# EasyEDA Pro project Adorkable_Base_V2_EXP.eprj

# Schematic Schematic1
Board Name: Board1; Create Date: 2024-12-17; Page Name: P1; Project Name: Adorkable_Base_V2_EXP; Schematic Name: Schematic1; Update Date: 2025-08-19; Company: 嘉立创EDA; Page Size: A4; Version: V1.0
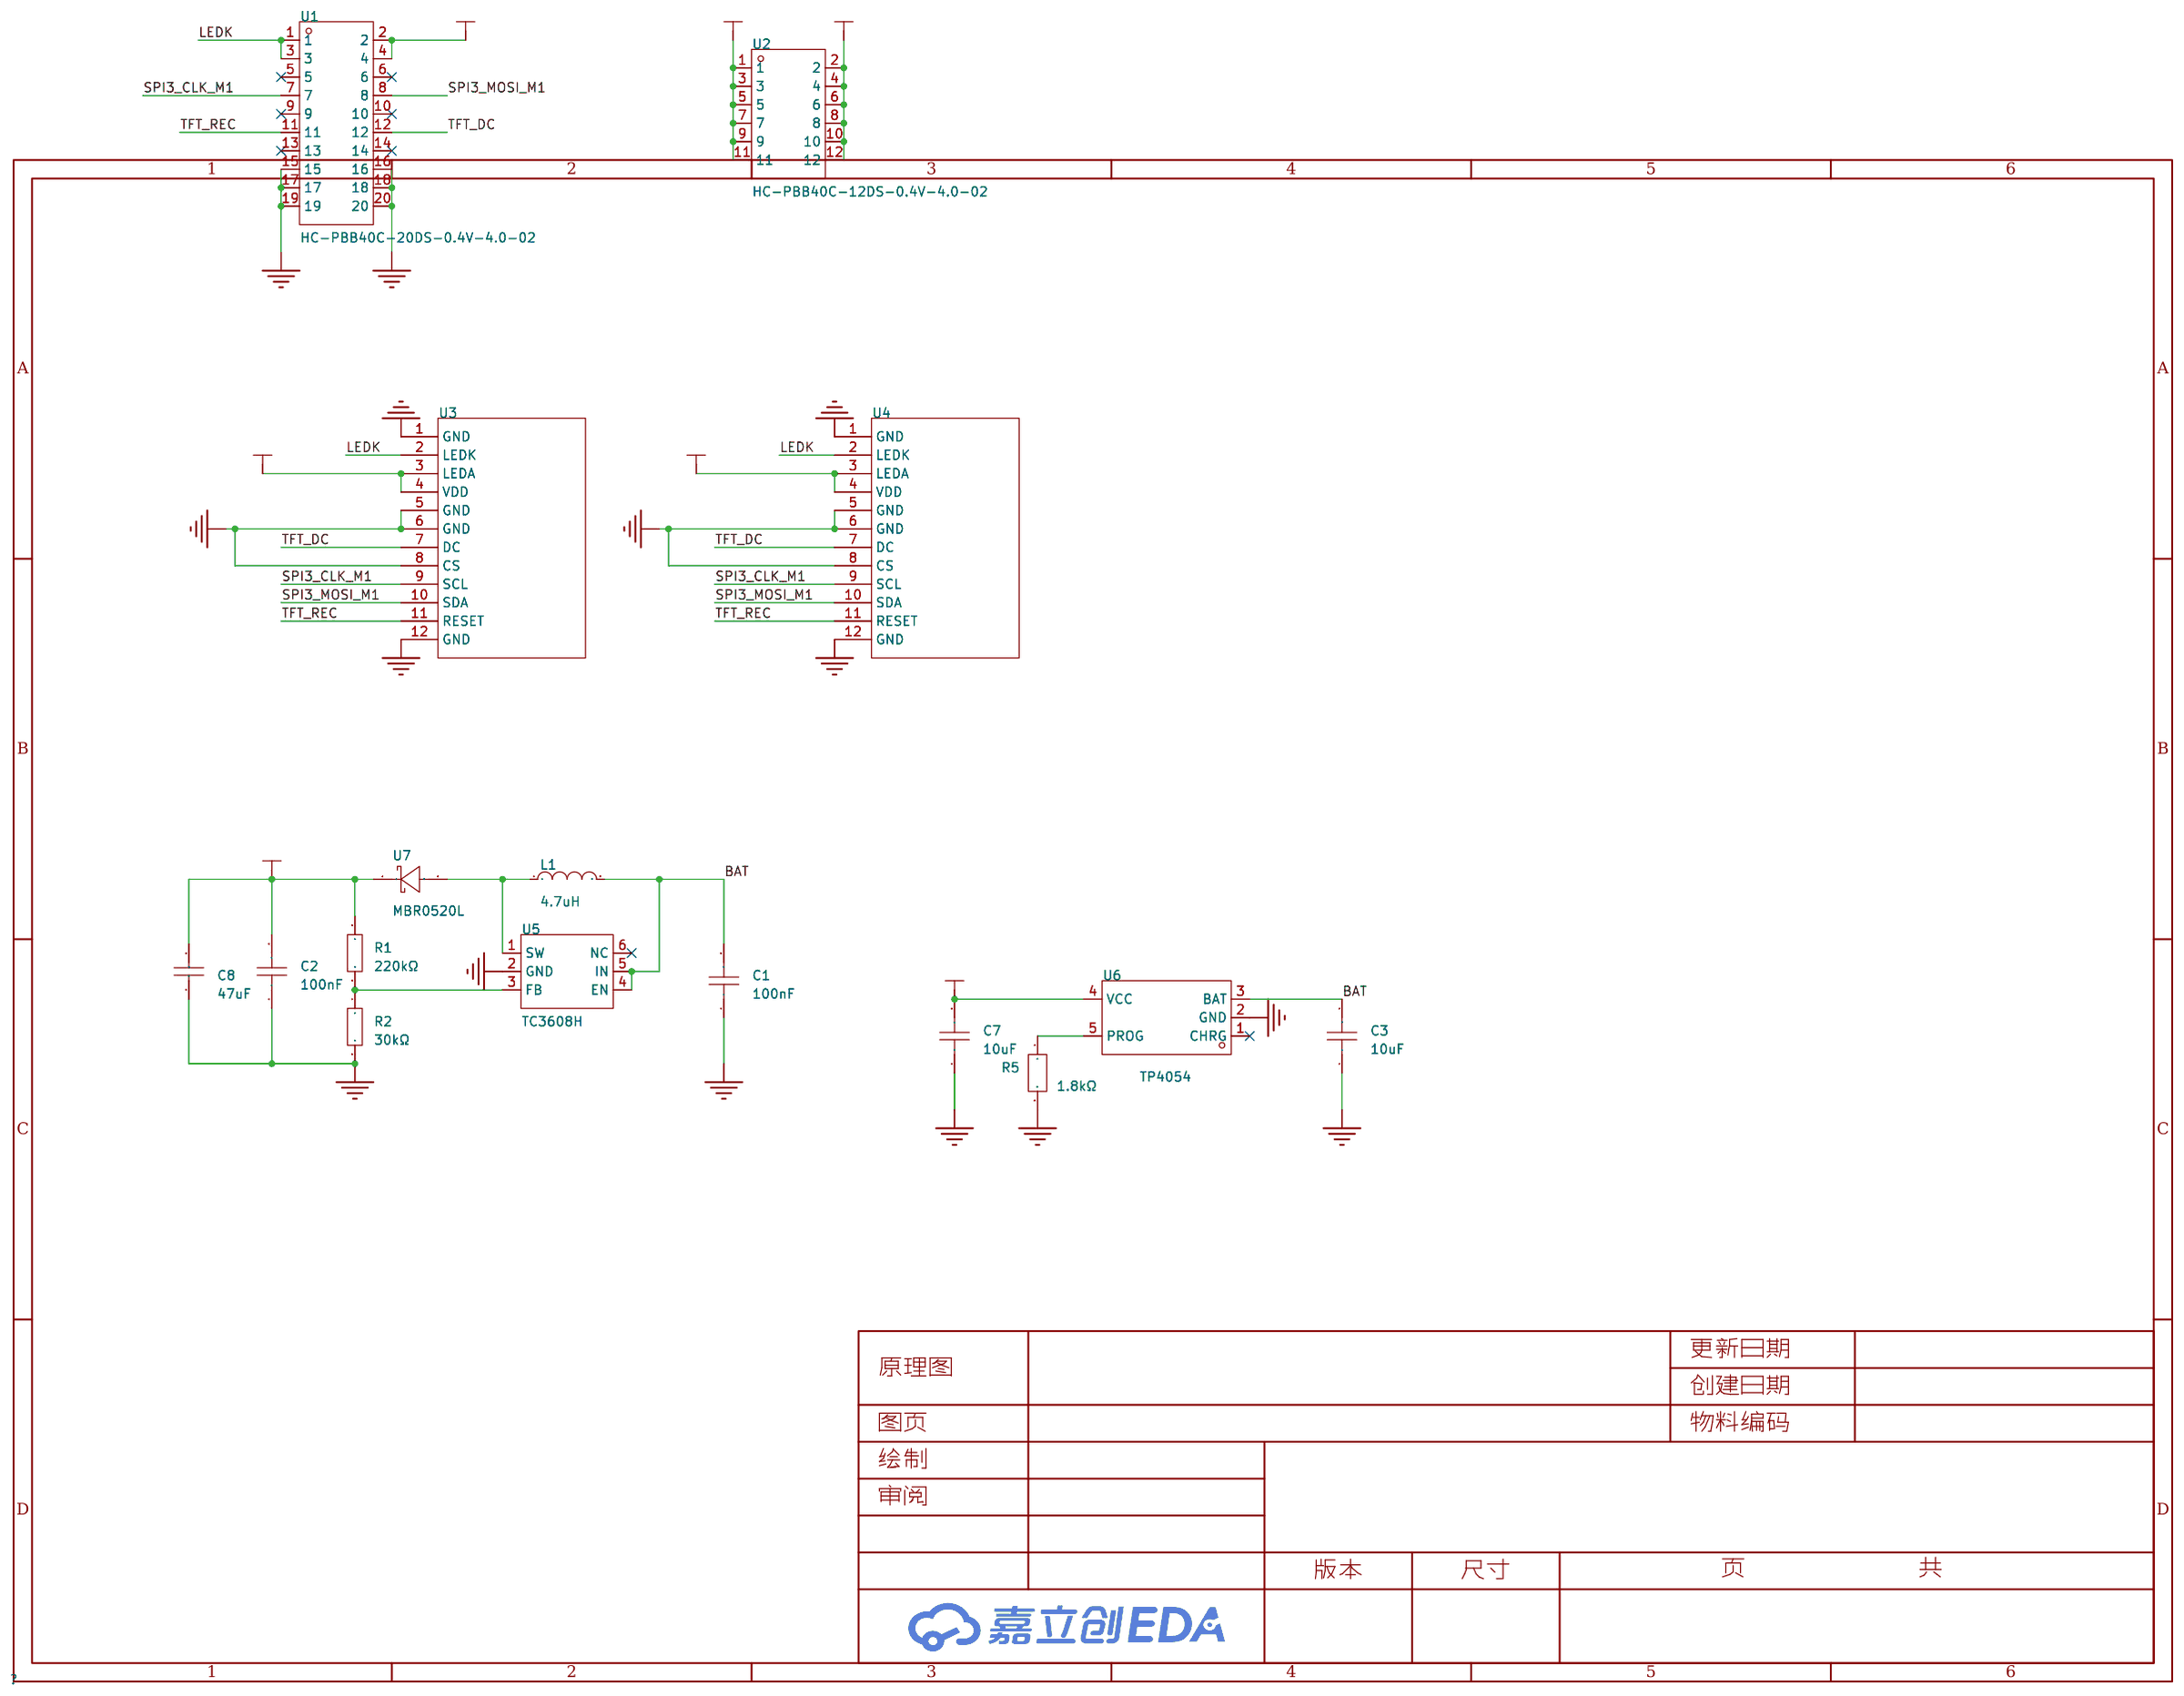
[diagram p0: schematic sheet]

## Parts
C1  100nF  [C0603]
C2  100nF  [C0603]
C3  10uF  [C0603]
C7  10uF  [C0603]
C8  47uF  [C0603]
L1  4.7uH  [IND-SMD_L2.5-W2.0-VLS252012CX-150M]
R1  220kΩ  [R0603]
R2  30kΩ  [R0603]
R5  1.8kΩ  [R0603]
U1  HC-PBB40C-20DS-0.4V-4.0-02  [CONN-SMD_20P-P0.40_DF40C-20DS-0.4V]
U2  HC-PBB40C-12DS-0.4V-4.0-02  [CONN-SMD_12P-P0.40_HC-PBB40C-12DS-0.4V]
U3  -  [LCD]
U4  -  [LCD]
U5  TC3608H  [SOT-23-6_L2.9-W1.6-P0.95-LS2.8-BR]
U6  TP4054  [TSOT-23-5_L2.9-W1.6-P0.95-LS2.8-BR]
U7  MBR0520L  [SOD-123_L2.7-W1.6-LS3.7-RD-1]

## Library data of the parts
C1 C2 = CL10B104KB8NNNC: 容值:100nF;精度:±10%;额定电压:50V;温度系数:X7R;; LCSC Part Name: 100nF ±10% 50V; Supplier Part: C1591; Manufacturer: SAMSUNG(三星); Supplier Footprint: 0603; JLCPCB Part Class: 扩展库; Datasheet: https://item.szlcsc.com/datasheet/CL10B104KB8NNNC/1943.html; Supplier: LCSC; Tolerance: ±10%; Voltage Rating: 50V; Temperature Coefficient: X7R
C3 C7 = CL10A106KP8NNNC: 容值:10uF;精度:±10%;额定电压:10V;温度系数:X5R;; LCSC Part Name: 10uF ±10% 10V; Supplier Part: C19702; Manufacturer: SAMSUNG(三星); Supplier Footprint: 0603; JLCPCB Part Class: 基础库; Datasheet: https://item.szlcsc.com/datasheet/CL10A106KP8NNNC/20411.html; Supplier: LCSC; Tolerance: ±10%; Voltage Rating: 10V; Temperature Coefficient: X5R
C8 = GRM188R60J476ME15D: LCSC Part Name: 47uF ±20% 6.3V; Supplier Part: C140782; Manufacturer: muRata(村田); Supplier Footprint: 0603; JLCPCB Part Class: 扩展库; Datasheet: https://atta.szlcsc.com/upload/public/pdf/source/20171113/C140782_15105612981581115778.pdf; Supplier: LCSC; Tolerance: ±20%; Voltage Rated: 6.3V; Temperature Coefficient: X5R
L1 = FTC252010S4R7MBCA: 电感值:4.7uH;精度:±20%;额定电流:2A;饱和电流(Isat):2.6A;类型:一体成型电感;; LCSC Part Name: 4.7uH ±20% 2.6A; Supplier Part: C5832360; Manufacturer: cjiang(长江微电); Supplier Footprint: SMD,2x2.5mm; JLCPCB Part Class: 扩展库; Datasheet: https://atta.szlcsc.com/upload/public/pdf/source/20230602/8FFEDA9C0247A92A0D4B67554BFE4091.pdf; Supplier: LCSC; Tolerance: ±20%; Rated Current: 2A; Saturation Current (Isat): 2.6A; DC Resistance (DCR): 160mΩ; Type: 一体成型电感
R1 = 0603WAF2203T5E: 电阻类型:厚膜电阻;阻值:220kΩ;精度:±1%;功率:100mW;工作电压:75V;温度系数:±100ppm/℃;; LCSC Part Name: 220kΩ ±1% 100mW 厚膜电阻; Supplier Part: C22961; Manufacturer: UNI-ROYAL(厚声); Supplier Footprint: 0603; JLCPCB Part Class: 基础库; Datasheet: https://item.szlcsc.com/datasheet/0603WAF2203T5E/23688.html; Supplier: LCSC; Type: 厚膜电阻; Tolerance: ±1%; Power(Watts): 100mW; Voltage-Supply(Max): 75V; Temperature Coefficient: ±100ppm/℃; Operating Temperature: -55℃~+155℃
R2 = 0603WAF3002T5E: 电阻类型:厚膜电阻;阻值:30kΩ;精度:±1%;功率:100mW;工作电压:75V;温度系数:±100ppm/℃;; LCSC Part Name: 30kΩ ±1% 100mW 厚膜电阻; Supplier Part: C22984; Manufacturer: UNI-ROYAL(厚声); Supplier Footprint: 0603; JLCPCB Part Class: 基础库; Datasheet: https://item.szlcsc.com/datasheet/0603WAF3002T5E/23711.html; Supplier: LCSC; Type: 厚膜电阻; Tolerance: ±1%; Power(Watts): 100mW; Voltage-Supply(Max): 75V; Temperature Coefficient: ±100ppm/℃; Operating Temperature: -55℃~+155℃
R5 = FRC0603F1801TS: 电阻类型:厚膜电阻;阻值:1.8kΩ;精度:±1%;功率:100mW;工作电压:75V;温度系数:±100ppm/℃;; LCSC Part Name: 1.8kΩ ±1% 100mW 厚膜电阻; Supplier Part: C2906979; Manufacturer: FOJAN(富捷); Supplier Footprint: 0603; JLCPCB Part Class: 扩展库; Datasheet: https://item.szlcsc.com/datasheet/FRC0603F1801TS/3180492.html; Supplier: LCSC; Type: 厚膜电阻; Tolerance: ±1%; Power(Watts): 100mW; Voltage-Supply(Max): 75V; Temperature Coefficient: ±100ppm/℃; Operating Temperature: -55℃~+155℃
U1 = HC-PBB40C-20DS-0.4V-4.0-02: LCSC Part Name: PIN:20P 间距:0.4mm 立贴; Supplier Part: C19089314; Manufacturer: HCTL(华灿天禄); Supplier Footprint: SMD,P=0.4mm; JLCPCB Part Class: 扩展库; Datasheet: https://atta.szlcsc.com/upload/public/pdf/source/20231026/B42C748D7AAFF63F7EC2104F4CEA0747.pdf; Supplier: LCSC; Number of Pins: 20P; Pitch: 0.4mm; Connection Type: 槽型对接; Mounting Type: 立贴; Number of Rows: 2; Current Rating: 300mA; System Fit Height: 4mm; Contact Plating: 金; Operating Temperature: -40℃~+85℃
U2 = HC-PBB40C-12DS-0.4V-4.0-02: LCSC Part Name: PIN:12P 间距:0.4mm 立贴; Supplier Part: C19089313; Manufacturer: HCTL(华灿天禄); Supplier Footprint: SMD,P=0.4mm; JLCPCB Part Class: 扩展库; Datasheet: https://atta.szlcsc.com/upload/public/pdf/source/20231026/B42C748D7AAFF63F7EC2104F4CEA0747.pdf; Supplier: LCSC; Number of Pins: 12P; Pitch: 0.4mm; Connection Type: 槽型对接; Mounting Type: 立贴; Number of Rows: 2; Current Rating: 300mA; System Fit Height: 4mm; Contact Plating: 金; Operating Temperature: -40℃~+85℃
U3 U4 = LCD
U5 = TC3608H_C3002521: 功能类型:升压型;输出类型:-;工作电压:2.3V~15V;输出电压:-;输出电流:-;; LCSC Part Name: 高效率1.2MHz DC-DC升压器IC; Supplier Part: C3002521; Manufacturer: FM(富满); Supplier Footprint: SOT-23-6; JLCPCB Part Class: 扩展库; Datasheet: https://atta.szlcsc.com/upload/public/pdf/source/20220425/E1BEB05E0AFFF970E932FD0A7FBE9F8A.pdf; Supplier: LCSC; Function: 升压型; Voltage - Supply: 2.3V~15V; Operating Temperature: -40℃~+85℃; Number of Outputs: 1; Topology: 升压式
U6 = TP4054_C668215: 电源电压:6.5V;最大充电电流:500mA;电池类型:锂离子/聚合物;电池节数:1;; Supplier Part: C668215; Manufacturer: UMW(友台半导体); Supplier Footprint: SOT-23-5L; JLCPCB Part Class: 扩展库; Datasheet: https://atta.szlcsc.com/upload/public/pdf/source/20231109/1E60770826C4E1A0E5898BBC08FF3A57.pdf; Supplier: LCSC; Supply Voltage: 6.5V; Maximum Charge Current: 500mA; Type of Battery: 锂离子/聚合物; Number of Cells: 1; Operating Temperature: -40℃~+85℃
U7 = MBR0520L_C5563735: 二极管配置:独立式;正向压降(Vf):385mV@500mA;直流反向耐压(Vr):20V;整流电流:500mA;; LCSC Part Name: 电压:20V 电流:500mA; Supplier Part: C5563735; Manufacturer: FUXINSEMI(富芯森美); Supplier Footprint: SOD-123; JLCPCB Part Class: 扩展库; Datasheet: https://item.szlcsc.com/datasheet/MBR0520L/6481309.html; Supplier: LCSC; Diode Configuration: 独立式; Voltage - Forward(Vf@If): 385mV@500mA; Voltage - DC Reverse(Vr): 20V; Current - Rectified: 500mA; Reverse Leakage Current (Ir): 250uA@20V; Operating Junction Temperature Range: -55℃~+125℃; Non-Repetitive Peak Forward Surge Current: 5.5A

## Nets
GND: C1.1 C2.1 C3.1 C7.1 C8.1 R2.2 R5.2 U1.15 U1.16 U1.17 U1.18 U1.19 U1.20 U3.1(GND) U3.5(GND) U3.6(GND) U3.8(CS) U3.12(GND) U4.1(GND) U4.5(GND) U4.6(GND) U4.8(CS) U4.12(GND) U5.2(GND) U6.2(GND)
VCC_3V3: U1.2 U1.4 U3.3(LEDA) U3.4(VDD) U4.3(LEDA) U4.4(VDD)
VCC_5V: C7.2 U2.1 U2.3 U2.5 U2.7 U2.9 U2.11 U6.4(VCC)
VCC_OUT: C2.2 C8.2 R1.1 U2.2 U2.4 U2.6 U2.8 U2.10 U2.12 U7.1
BAT: C1.2 C3.2 L1.2 U5.4(EN) U5.5(IN) U6.3(BAT)
LEDK: U1.1 U1.3 U3.2(LEDK) U4.2(LEDK)
SPI3_CLK_M1: U1.7 U3.9(SCL) U4.9(SCL)
SPI3_MOSI_M1: U1.8 U3.10(SDA) U4.10(SDA)
TFT_DC: U1.12 U3.7(DC) U4.7(DC)
TFT_REC: U1.11 U3.11(RESET) U4.11(RESET)
$1N16814: L1.1 U5.1(SW) U7.2
$1N16818: R1.2 R2.1 U5.3(FB)
$1N16827: R5.1 U6.5(PROG)

Not connected (* = marked no-connect by the designer): U1 5* 6* 9* 10* 13* 14*; U5 6(NC)*; U6 1(CHRG)*

# Board PCB1
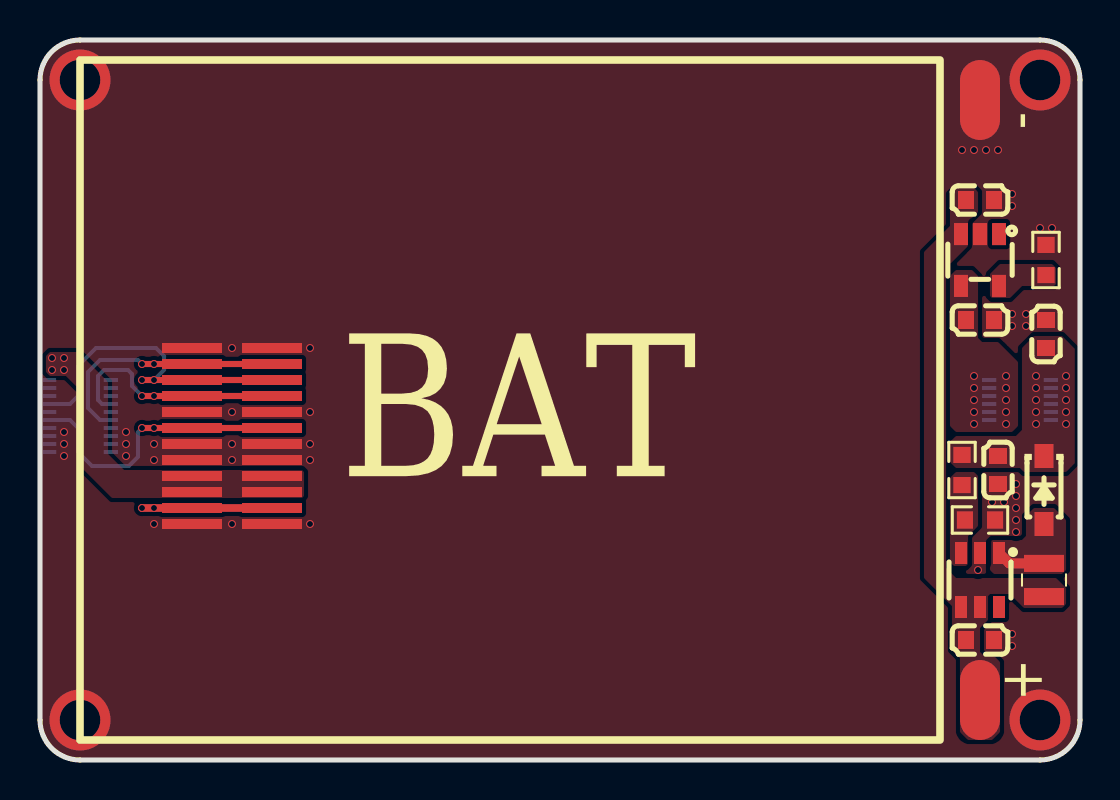
[diagram p1: board, top side]
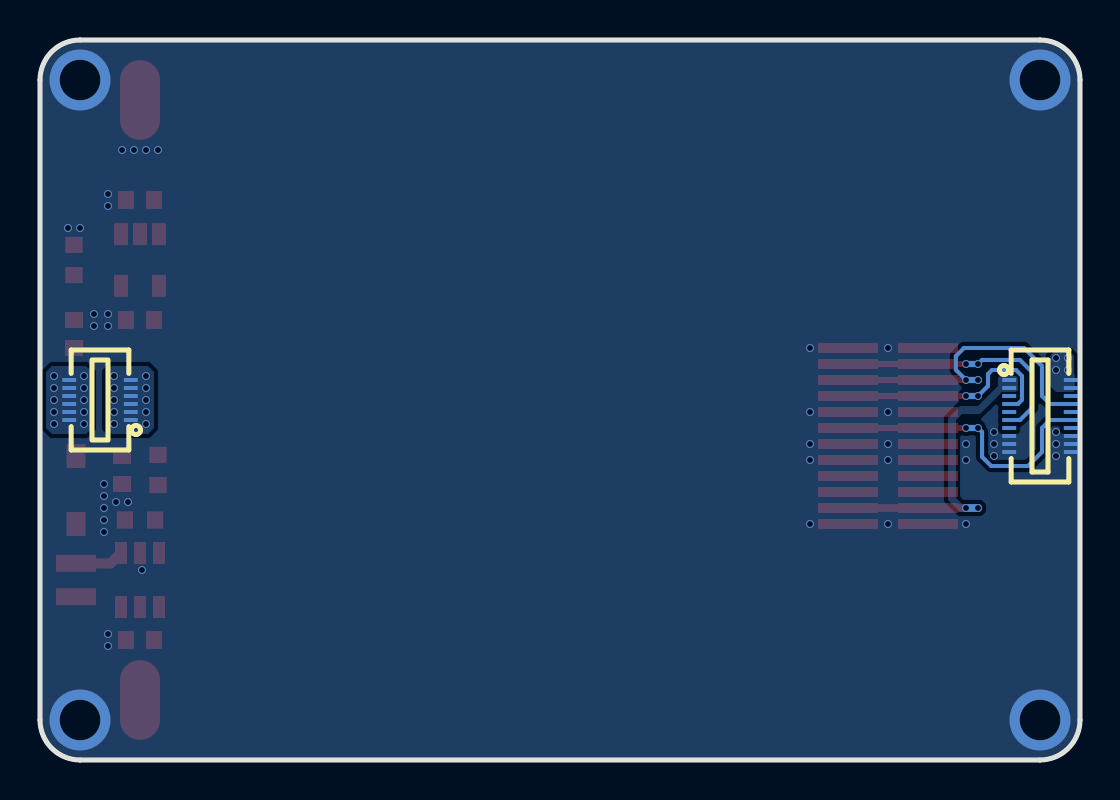
[diagram p2: board, bottom side, seen from below]

Outline 52 x 36 mm; copper layers: Top Layer, Bottom Layer. Coordinates in mm from the lower left corner of the outline.
Outline path: 0,34 arc(0.59,35.41) 2,36 50,36 arc(51.41,35.41) 52,34 52,2 arc(51.41,0.59) 50,0 2,0 arc(0.59,0.59) 0,2 0,34
Stack: Top Layer 0.035mm / Dielectric1 0.51mm FR4 er 4.5 / Bottom Layer 0.035mm

## Design rules (mm)
template: 自定义配置
spacing copperThickness1oz (default): track to track 0.102, other pairs 0 to 0.3
spacing copperThickness2oz: track to track 0.203, other pairs 0.152 to 0.3
track width copperThickness1oz (default): min 0.127, default 0.127, max 2.54
track width copperThickness2oz: min 0.127, default 0.127, max 2.54
differential pair differentialPair (default): width min 0.102, default 0.122, max 2.54; gap min 0.127, default 0.127
via viaSize (default): diameter min 0.399, default 0.399, max 10; hole min 0.3, default 0.3, max 10
net GND uses VCC

## Placement (name value [footprint] x y rotation side)
C1  100nF  [C0603]  47 6 180 top
C2  100nF  [C0603]  47.9 14.5 90 top
C3  10uF  [C0603]  47 28 180 top
C7  10uF  [C0603]  47 22 180 top
C8  47uF  [C0603]  50.3 21.3 270 top
L1  4.7uH  [IND-SMD_L2.5-W2.0-VLS252012CX-150M]  50.2 9 270 top
NOREF  -  [Pad_e72]  47 33 0 top
NOREF#2  -  [Pad_e70]  47 3 0 top
R1  220kΩ  [R0603]  46.1 14.5 270 top
R2  30kΩ  [R0603]  47 12 0 top
R5  1.8kΩ  [R0603]  50.3 25 90 top
U1  HC-PBB40C-20DS-0.4V-4.0-02  [CONN-SMD_20P-P0.40_DF40C-20DS-0.4V]  2 17.2 270 bottom
U2  HC-PBB40C-12DS-0.4V-4.0-02  [CONN-SMD_12P-P0.40_HC-PBB40C-12DS-0.4V]  49 18 90 bottom
U3  -  [LCD]  11.6 11.8 0 top
U4  -  [LCD]  7.6 11.8 0 top
U5  TC3608H  [SOT-23-6_L2.9-W1.6-P0.95-LS2.8-BR]  47 9 90 top
U6  TP4054  [TSOT-23-5_L2.9-W1.6-P0.95-LS2.8-BR]  47 25 90 top
U7  MBR0520L  [SOD-123_L2.7-W1.6-LS3.7-RD-1]  50.2 13.5 270 top

## Footprints (pads in the part's own frame, mm; a bottom-side part is the same pattern mirrored in y, then rotated)
C0603
  rect 0.8x0.9 smd: 1(-0.7,0) 2(0.7,0)
CONN-SMD_12P-P0.40_HC-PBB40C-12DS-0.4V
  rect 0.2x0.7 smd: 1(-1,-1.54) 2(-1,1.54) 3(-0.6,-1.54) 4(-0.6,1.54) 5(-0.2,-1.54) 6(-0.2,1.54) 7(0.2,-1.54) 8(0.2,1.54) 9(0.6,-1.54) 10(0.6,1.54) 11(1,-1.54) 12(1,1.54)
CONN-SMD_20P-P0.40_DF40C-20DS-0.4V
  rect 0.2x0.7 smd: 1(-1.8,-1.54) 2(-1.8,1.54) 3(-1.4,-1.54) 4(-1.4,1.54) 5(-1,-1.54) 6(-1,1.54) 7(-0.6,-1.54) 8(-0.6,1.54) 9(-0.2,-1.54) 10(-0.2,1.54) 11(0.2,-1.54) 12(0.2,1.54) 13(0.6,-1.54) 14(0.6,1.54) 15(1,-1.54) 16(1,1.54) 17(1.4,-1.54) 18(1.4,1.54) 19(1.8,-1.54) 20(1.8,1.54)
IND-SMD_L2.5-W2.0-VLS252012CX-150M
  rect 0.85x2 smd: 1(-0.83,0) 2(0.83,0)
LCD
  rect 3x0.5 smd: 1(0,0) 2(0,0.8) 3(0,1.6) 4(0,2.4) 5(0,3.2) 6(0,4) 7(0,4.8) 8(0,5.6) 9(0,6.4) 10(0,7.2) 11(0,8) 12(0,8.8)
Pad_e70
  rrect 2x4 smd: 1(0,0)
Pad_e72
  rrect 2x4 smd: 2(0,0)
R0603
  rect 0.806x0.864 smd: 1(-0.753,0) 2(0.753,0)
SOD-123_L2.7-W1.6-LS3.7-RD-1
  rect 1.2x0.95 smd: 1(-1.7,0) 2(1.7,0)
SOT-23-6_L2.9-W1.6-P0.95-LS2.8-BR
  rect 1.1x0.6 smd: 1(1.35,-0.95) 2(1.35,0) 3(1.35,0.95) 4(-1.35,0.95) 5(-1.35,0) 6(-1.35,-0.95)
TSOT-23-5_L2.9-W1.6-P0.95-LS2.8-BR
  rect 1.1x0.7 smd: 1(1.294,-0.951) 2(1.294,-0.001) 3(1.294,0.951) 4(-1.294,0.951) 5(-1.294,-0.949)

## Nets
As in the schematic, except:
GND: C1.1 C2.1 C3.1 C7.1 C8.1 NOREF.2 R2.2 R5.2 U1.15 U1.16 U1.17 U1.18 U1.19 U1.20 U3.1 U3.5 U3.6 U3.8 U3.12 U4.1 U4.5 U4.6 U4.8 U4.12 U5.2 U6.2
BAT: C1.2 C3.2 L1.2 NOREF#2.1 U5.4 U5.5 U6.3

Pads without a net: U1 5 6 9 10 13 14; U5 6; U6 1

## Via types
v1: diameter 0.399, hole 0.299, Top Layer to Bottom Layer, 75 vias
v2: diameter 3.048, hole 2.032, Top Layer to Bottom Layer, 4 vias

## Routing (per net, layer and track width the routed paths; a pad name or vN(x,y) marks a point on that pad's centre or on a via; arc(x,y) is an arc through that point)
GND:
  vias: v1(1.2,16.4) v1(1.2,15.8) v1(1.2,15.2) v1(4.3,16.4) v1(4.3,15.8) v1(4.3,15.2) v1(5.7,15.8) v1(5.7,15) v1(5.7,11.8) v1(9.6,20.6) v1(9.6,17.4) v1(9.6,15.8) v1(9.6,15) v1(9.6,11.8) v1(13.5,20.6) v1(13.5,17.4) v1(13.5,15.8) v1(13.5,15) v1(13.5,11.8) v1(46.1,30.5) v1(46.7,30.5) v1(46.9,9.5) v1(47.3,30.5) v1(47.6,12.9) v1(47.9,30.5) v1(48.2,12.9) v1(48.6,28.3) v1(48.6,27.7) v1(48.6,22.3) v1(48.6,21.7) v1(48.6,6.3) v1(48.6,5.7) v1(48.8,13.8) v1(48.8,13.2) v1(48.8,12.6) v1(48.8,12) v1(48.8,11.4) v1(49.3,22.3) v1(49.3,21.7) v1(50,26.6) v1(50.6,26.6) v2(2,34) v2(2,2) v2(50,34) v2(50,2)
VCC_3V3:
  vias: v1(0.6,20.1) v1(0.6,19.5) v1(1.2,20.1) v1(1.2,19.5)
VCC_5V:
  vias: v1(46.7,19.2) v1(46.7,18.6) v1(46.7,18) v1(46.7,17.4) v1(46.7,16.8) v1(48.3,19.2) v1(48.3,18.6) v1(48.3,18) v1(48.3,17.4) v1(48.3,16.8)
VCC_OUT:
  vias: v1(49.8,19.2) v1(49.8,18.6) v1(49.8,18) v1(49.8,17.4) v1(49.8,16.8) v1(51.3,19.2) v1(51.3,18.6) v1(51.3,18) v1(51.3,17.4) v1(51.3,16.8)
LEDK: length 7.1
  Top Layer w0.381: v1(5.1,12.6) v1(5.7,12.6) U4.2 U3.2
  Bottom Layer w0.381: v1(5.7,12.6) v1(5.1,12.6)
SPI3_CLK_M1: length 12.2
  Top Layer w0.305: U3.9 U4.9 v1(5.7,18.2) v1(5.1,18.2)
  Bottom Layer w0.203: U1.7 3.1,17.8 2.9,18 2.9,19.2 3.2,19.5 4.4,19.5 4.6,19.3 4.6,18.7 v1(5.1,18.2)
  Bottom Layer w0.305: v1(5.7,18.2) v1(5.1,18.2)
SPI3_MOSI_M1: length 16.5
  Top Layer w0.305: v1(5.1,19) v1(5.7,19) U4.10 U3.10
  Bottom Layer w0.203: v1(5.7,19) 6.21,19.51 6.21,20.19 5.8,20.6 2.8,20.6 1.9,19.7 1.9,18.2 1.5,17.8 U1.8
  Bottom Layer w0.305: v1(5.1,19) v1(5.7,19)
TFT_DC: length 14.9
  Top Layer w0.305: v1(5.1,16.6) v1(5.7,16.6) U4.7 U3.7
  Bottom Layer w0.203: U1.12 1.5,17 1.9,16.6 1.9,15.4 2.6,14.7 4.44,14.7 4.9,15.16 4.9,16.4 v1(5.1,16.6)
  Bottom Layer w0.305: v1(5.7,16.6) v1(5.1,16.6)
TFT_REC: length 13.3
  Top Layer w0.305: v1(5.1,19.8) v1(5.7,19.8) U4.11 U3.11
  Bottom Layer w0.203: v1(5.1,19.8) 4.9,20 3,20 2.4,19.4 2.4,17.6 3,17 U1.11
  Bottom Layer w0.305: v1(5.7,19.8) v1(5.1,19.8)
$1N16814: length 2.5
  Top Layer w0.508: L1.1 48.47,9.83 U5.1

## Copper pours and planes (outline as drawn; the poured copper is in the pictures)
GND on Top Layer: -0.2,36.2 52.2,36.2 52.2,-0.2 -0.2,-0.2
GND on Bottom Layer: -0.2,36.2 52.2,36.2 52.2,-0.2 -0.2,-0.2
VCC_3V3 on Top Layer: 13.1,14.5 13.2,14.4 13.2,13.2 13.1,13.1 3.6,13.1 2.1,14.6 2.1,18.4 1.3,19.2 0.5,19.2 0.3,19.4 0.3,20.2 0.5,20.4 1.9,20.4 3.4,18.9 3.4,15.3 4.2,14.5
VCC_3V3 on Bottom Layer: 0.2,19.2 0.3,19.3 0.3,20.2 0.5,20.4 1.3,20.4 1.5,20.2 1.5,18.7 1.2,18.4 0.3,18.4 0.2,18.5
VCC_5V on Top Layer: 48.6,16.4 48.9,16.7 48.9,19.9 47.9,20.9 47.1,20.9 46.9,21.1 46.9,24.2 46.6,24.5 45.8,24.5 45.5,24.2 45.5,16.7 45.8,16.4
VCC_5V on Bottom Layer: 48.4,19.7 48.7,19.4 48.7,16.6 48.4,16.3 46.6,16.3 46.3,16.6 46.3,19.4 46.6,19.7
VCC_OUT on Top Layer: 45.5,14.9 45.8,14.6 49,14.6 49.2,14.4 51.3,14.4 51.8,14.9 51.8,20.5 51.1,21.2 49.7,21.2 49.1,20.6 49.1,16.5 48.8,16.2 45.8,16.2 45.5,15.9
VCC_OUT on Bottom Layer: 49.4,19.4 49.7,19.7 51.4,19.7 51.7,19.4 51.7,16.6 51.4,16.3 49.7,16.3 49.4,16.6
BAT on Top Layer: 46.4,25.7 46.4,26.9 46.9,27.4 46.9,28.4 46.7,28.6 45.8,28.6 45.5,28.3 45.5,26.7 44.2,25.4 44.2,9.1 45.7,7.6 46.4,7.6 46.7,7.9 46.7,8.7 46.3,9.1 45.8,9.1 45.3,9.6 45.3,24.6
BAT on Top Layer: 51.1,7.6 51.3,7.8 51.3,8.6 50.8,9.1 46.1,9.1 45.6,8.6 45.6,5.5 46,5.1 46,1.4 46.4,1 47.6,1 48,1.4 48,4.9 47.7,5.2 47.2,5.2 47,5.4 47,6.6 47.4,7 47.4,8.2 47.5,8.3 48.5,8.3 49.2,7.6
LEDK on Bottom Layer: 3.2,19.2 3.1,19.1 3.1,18.5 3.2,18.4 3.9,18.4 5,17.3 5.9,17.3 6.2,17 6.2,13.1 5.9,12.8 5,12.8 4.9,12.7 4.9,12.5 5,12.4 6,12.4 6.6,13 6.6,17.1 6,17.7 5.1,17.7 4.1,18.7 4.1,19.1 4,19.2
$1N16814 on Top Layer: 47.5,10.9 47.6,11 49.1,11 49.3,11.2 49.3,12.2 49.7,12.6 50.7,12.6 51.3,12 51.3,9.5 51.1,9.3 47.7,9.3 47.5,9.5
$1N16818 on Top Layer: 46.9,14.2 46.7,14.4 45.8,14.4 45.5,14.1 45.5,9.9 45.7,9.7 46.3,9.7 46.4,9.8 46.4,11.2 46.9,11.7
$1N16827 on Top Layer: 47.5,23.2 47.6,23.1 48.5,23.1 49.1,23.7 50.7,23.7 50.8,23.8 50.8,24.6 50.6,24.8 48,24.8 47.5,24.3

## Text on the board
Top Silkscreen Layer: - | + | BAT
